# EasyEDA Pro project ProDoc_ChisFlash-MBCX-CQZ_2025-11-29.epro, board ChisFlash-MBCX-CQZ
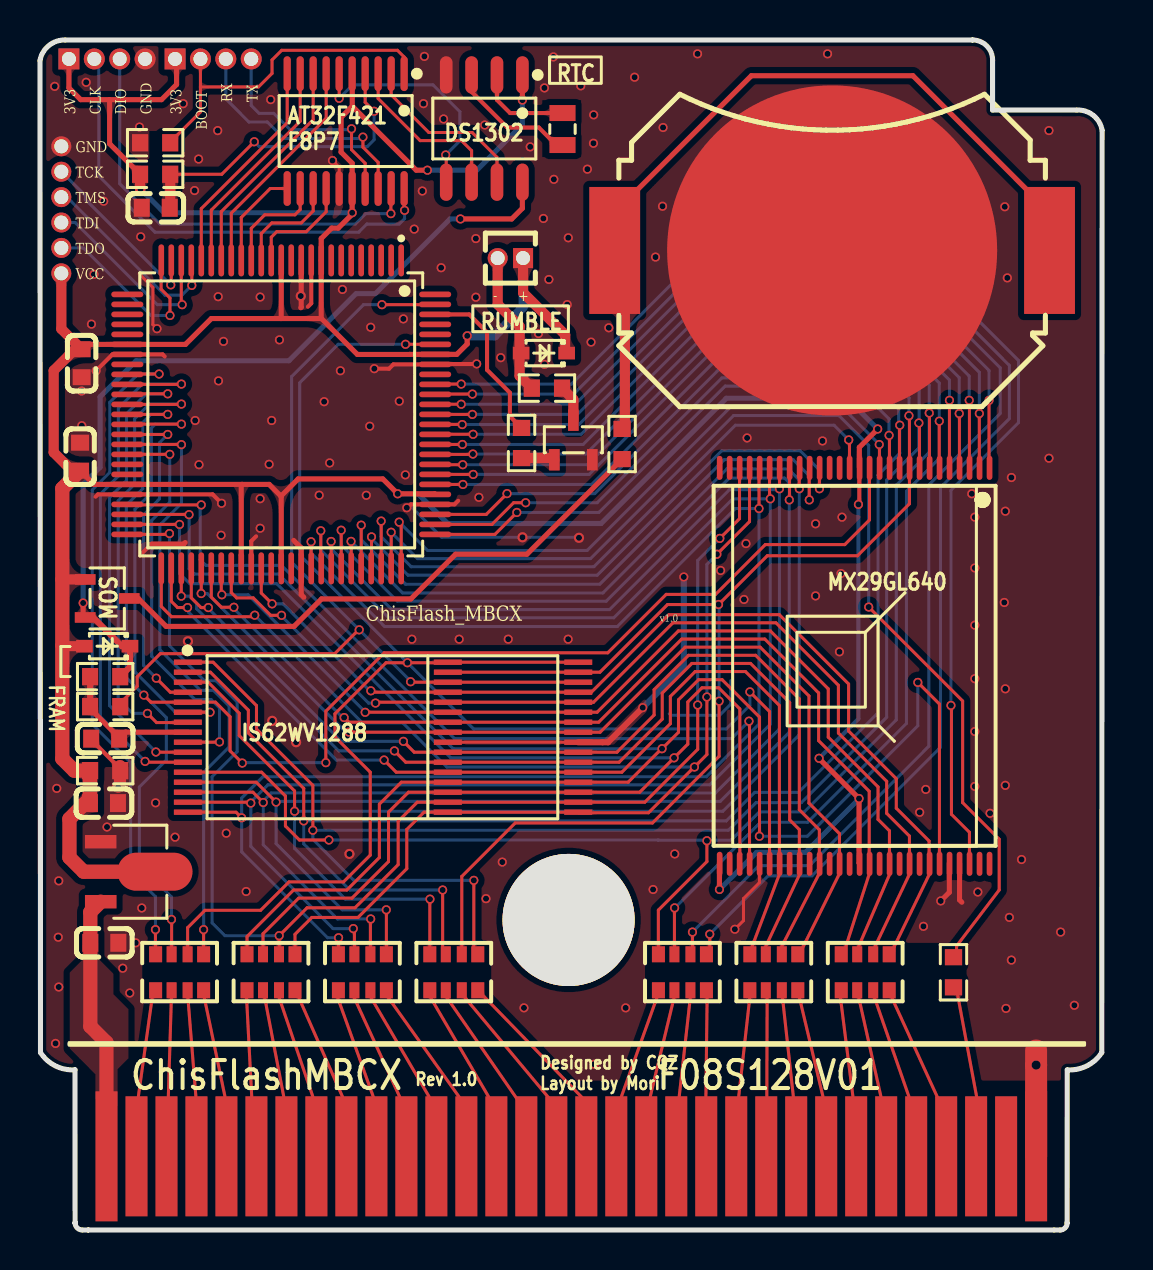
[diagram p1: board, top side]
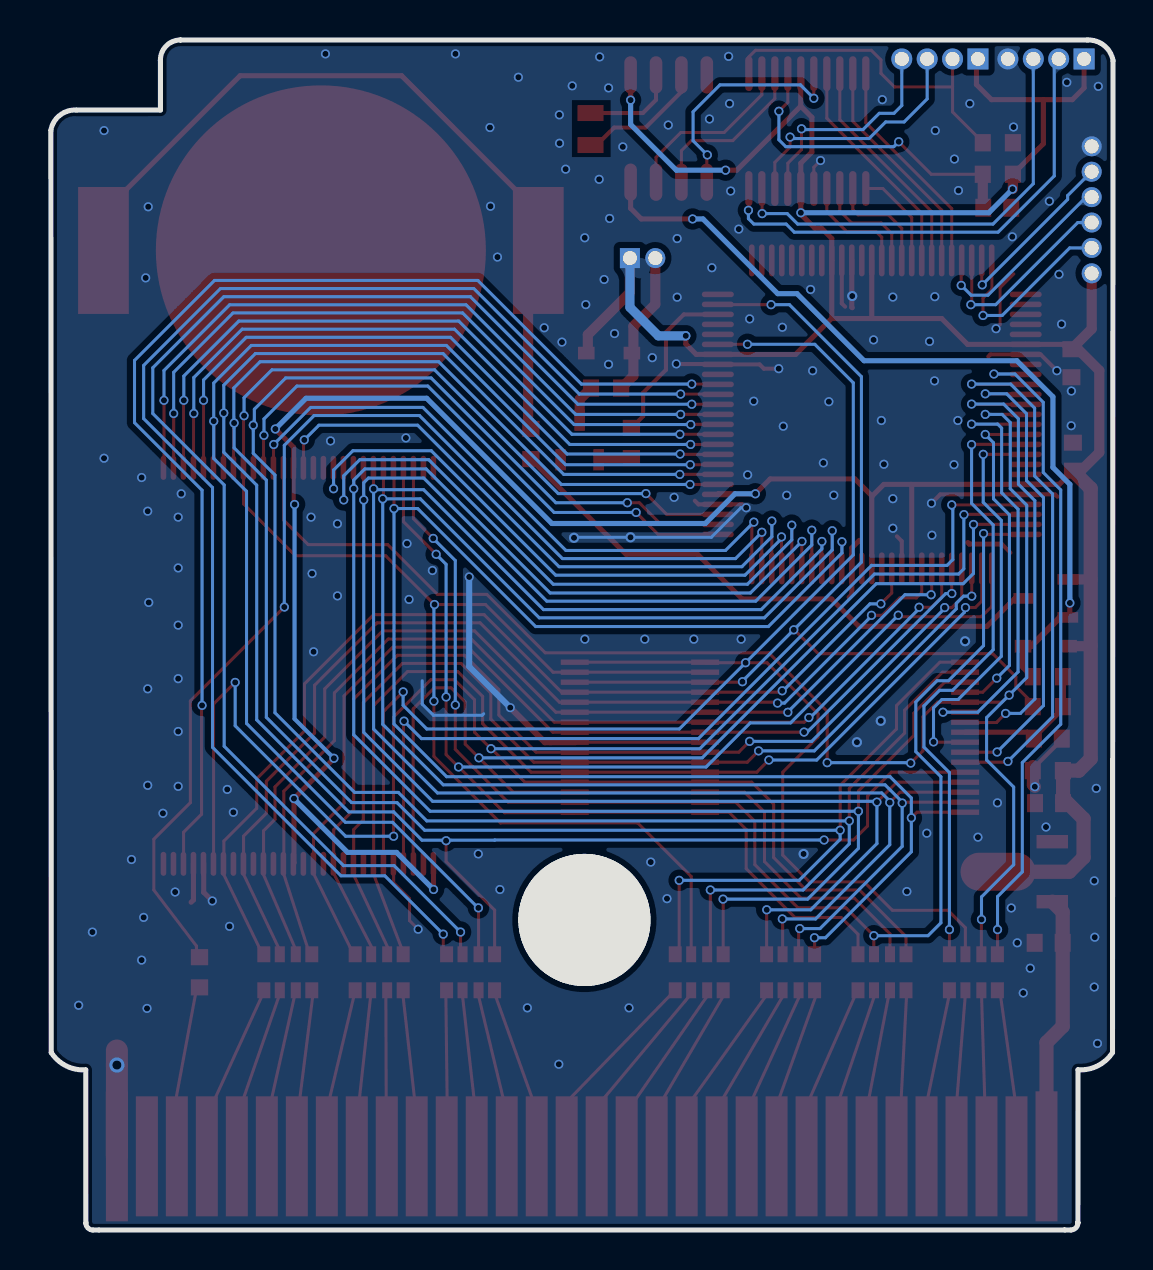
[diagram p2: board, bottom side, seen from below]

Outline 53.13 x 59.5 mm; copper layers: Top Layer, Bottom Layer. Coordinates in mm from the lower left corner of the outline.
Outline path: 1.76,0.36 1.76,0.36 arc(1.76,0.36) 1.76,0.36 ; 1.76,0.36 1.75,8.01 arc(0.77,8.21) 0.03,8.87 0,58.48 arc(0.45,59.23) 1.27,59.5 46.65,59.5 arc(47.36,59.21) 47.65,58.49 47.65,56 51.86,56 arc(52.69,55.74) 53.13,54.99 53.11,8.87 arc(52.37,8.21) 51.38,8.01 51.38,0.35 51.38,0.35 arc(51.28,0.1) 51.03,0 2.11,0 arc(1.86,0.11) 1.76,0.36
Stack: Top Layer 0.035mm / Dielectric1 1.51mm FR4 er 4.5 / Bottom Layer 0.035mm

## Design rules (mm)
template: 自定义配置
spacing copperThickness1oz (default): track to track 0.254, other pairs 0.152 to 0.152
spacing copperThickness2oz: track to track 0.203, other pairs 0.152 to 0.3
track width copperThickness1oz (default): min 0.152, default 0.152, max 2.54
track width copperThickness2oz: min 0.203, default 0.254, max 2.54
differential pair differentialPair (default): width min 0.127, default 0.254, max 2.54; gap min 0.152, default 0.152
via viaSize (default): diameter min 0.457, default 0.457, max 10; hole min 0.3, default 0.305, max 6.299

## Placement (name value [footprint] x y rotation side)
BT1  MY-2016-02  [BAT-SMD_MY-2032-08]  39.62 48.98 180 top
C2  100nF  [C0603]  3.26 24.57 0 top
C3  100nF  [C0603]  2.08 43.34 90 top
C4  100nF  [C0603]  2.01 38.67 270 top
C5  10uF  [C0603]  3.22 14.36 180 top
C6  10uF  [C0603]  3.2 21.34 180 top
C7  100nF  [C0603]  5.79 51.11 180 top
D1  RB751V-40  [SOD-323_L1.7-W1.3-LS2.6-RD-1]  3.36 29.19 180 top
D2  RB751V-40  [SOD-323_L1.7-W1.3-LS2.6-RD-1]  25.21 43.85 180 top
H3  PZ127V-11-02-H25  [HDR-TH_2P-P1.27-V-M-1]  23.53 48.6 180 top
J1  -  [ChisFlash-GBC卡框]  26.44 15.5 0 top
Q1  AO3415A  [SOT-23-3_L3.0-W1.7-P0.95-LS2.9-BR]  3.36 31.58 180 top
Q2  S8050  [SOT-23-3_L2.9-W1.3-P1.90-LS2.3-BR]  26.68 39.5 270 top
R1  10kΩ  [R0603]  3.26 26.17 180 top
R2  10kΩ  [R0603]  29.12 39.3 270 top
R3  10kΩ  [R0603]  3.26 22.97 0 top
R4  33Ω  [R0603]  45.69 12.89 270 top
R5  10kΩ  [R0603]  5.76 54.36 180 top
R6  10kΩ  [R0603]  5.76 52.79 180 top
R7  33Ω  [R0603]  25.36 42.1 180 top
R8  10kΩ  [R0603]  24.09 39.35 90 top
R9  0Ω  [R0603]  3.26 27.67 180 top
RN1  470Ω  [RES-ARRAY-SMD_0603-8P-L3.2-W1.6-BL]  11.56 12.89 0 top
RN2  470Ω  [RES-ARRAY-SMD_0603-8P-L3.2-W1.6-BL]  20.7 12.89 0 top
RN3  470Ω  [RES-ARRAY-SMD_0603-8P-L3.2-W1.6-BL]  16.13 12.89 0 top
RN4  470Ω  [RES-ARRAY-SMD_0603-8P-L3.2-W1.6-BL]  32.14 12.89 0 top
RN5  470Ω  [RES-ARRAY-SMD_0603-8P-L3.2-W1.6-BL]  36.71 12.89 0 top
RN6  470Ω  [RES-ARRAY-SMD_0603-8P-L3.2-W1.6-BL]  41.28 12.89 0 top
RN7  33Ω  [RES-ARRAY-SMD_0603-8P-L3.2-W1.6-BL]  6.98 12.89 0 top
U3  SRAM&FRAM-4M(512K)  [TSSOP-TSOP二合一_1]  18.16 24.62 180 top
U4  EPM240T100C5N  [TQFP-100_L14.0-W14.0-P0.50-LS16.0-BL]  12.07 40.78 180 top
U5  S29GL256N10TFI010  [TSOP-56_L18.4-W14.0-P0.50-LS20.0-TL]  40.75 28.21 270 top
U7  AT32F421F8P7  [TSSOP-20_L6.5-W4.4-P0.65-LS6.4-BL]  15.29 54.95 180 top
U9  DS1302Z  [SOP-8_L4.9-W3.9-P1.27-LS6.0-BL-1]  22.22 55.08 180 top
U10  AMS1117-3.3S  [SOT-89-3_L4.5-W2.5-P1.50-LS4.2-BR]  4.39 17.92 180 top
U12  X1311WR-04J-C40D24  [HDR-TH_4P-P1.27-H-M-W7.0-N_1]  3.35 58.56 0 top
U13  X1311WR-04J-C40D24  [HDR-TH_4P-P1.27-H-M-W7.0-N_1]  8.66 58.56 0 top
X1  32.768kHz  [CRYSTAL-SMD_2P-L2.0-W1.2]  26.14 55.05 90 top
XP1  JTAG  [HDR-TH_6P-P1.27-V-M-1]  1.07 51.01 90 top

## Footprints (pads in the part's own frame, mm; a bottom-side part is the same pattern mirrored in y, then rotated)
BAT-SMD_MY-2032-08
  rect 2.54x6.35 smd: 1(-10.875,0) 1(10.875,0)
  round 16.51 smd: 2(0,0)
C0603
  rect 0.8x0.9 smd: 1(-0.7,0) 2(0.7,0)
ChisFlash-GBC卡框
  round 6.604 hole 6.604: 0(0,0)
  rect 1.1x6.5 smd: 1(-23.114,-11.819) 32(23.386,-11.819)
  rect 1.1x6 smd: 2(-21.614,-11.819) 3(-20.114,-11.819) 4(-18.614,-11.819) 5(-17.114,-11.819) 6(-15.614,-11.819) 7(-14.114,-11.819) 8(-12.614,-11.819) 9(-11.114,-11.819) 10(-9.614,-11.819) 11(-8.114,-11.819) 12(-6.614,-11.819) 13(-5.114,-11.819) 14(-3.614,-11.819) 15(-2.114,-11.819) 16(-0.614,-11.819) 17(0.886,-11.819) 18(2.386,-11.819) 19(3.886,-11.819) 20(5.386,-11.819) 21(6.886,-11.819) 22(8.386,-11.819) 23(9.886,-11.819) 24(11.386,-11.819) 25(12.886,-11.819) 26(14.386,-11.819) 27(15.886,-11.819) 28(17.386,-11.819) 29(18.886,-11.819) 30(20.386,-11.819) 31(21.886,-11.819)
CRYSTAL-SMD_2P-L2.0-W1.2
  rect 0.8x1.3 smd: 1(-0.8,0) 2(0.8,0)
HDR-TH_2P-P1.27-V-M-1
  rect 1x1 hole 0.7: 1(-0.635,0)
  round 1 hole 0.7: 2(0.635,0)
HDR-TH_4P-P1.27-H-M-W7.0-N_1
  rect 1.05x1.05 hole 0.7: 1(-1.905,0)
  round 1.05 hole 0.7: 2(-0.635,0) 3(0.635,0) 4(1.905,0)
HDR-TH_6P-P1.27-V-M-1
  round 1 hole 0.7: 1(-3.175,0) 2(-1.905,0) 3(-0.635,0) 4(0.635,0) 5(1.905,0) 6(3.175,0)
R0603
  rect 0.806x0.864 smd: 1(-0.753,0) 2(0.753,0)
RES-ARRAY-SMD_0603-8P-L3.2-W1.6-BL
  rect 0.65x0.8 smd: 1(-1.2,-0.9) 4(1.2,-0.9) 5(1.2,0.9) 8(-1.2,0.9)
  rect 0.5x0.8 smd: 2(-0.4,-0.9) 3(0.4,-0.9) 6(0.4,0.9) 7(-0.4,0.9)
SOD-323_L1.7-W1.3-LS2.6-RD-1
  rect 0.83x0.63 smd: 1(-1.14,0) 2(1.14,0)
SOP-8_L4.9-W3.9-P1.27-LS6.0-BL-1
  oval 0.63x1.865 smd: 1(-1.905,-2.683) 2(-0.635,-2.683) 3(0.635,-2.683) 4(1.905,-2.683) 5(1.905,2.683) 6(0.635,2.683) 7(-0.635,2.683) 8(-1.905,2.683)
SOT-23-3_L2.9-W1.3-P1.90-LS2.3-BR
  rect 1.07x0.532 smd: 1(0.99,-0.95) 2(0.99,0.95) 3(-0.99,0)
SOT-23-3_L3.0-W1.7-P0.95-LS2.9-BR
  rect 1.038x0.532 smd: 1(1.101,-0.95) 2(1.101,0.95) 3(-1.101,0)
SOT-89-3_L4.5-W2.5-P1.50-LS4.2-BR
  rect 1.575x0.672 smd: 1(1.356,-1.5) 3(1.356,1.5)
  custom 5.377x1.9 smd: 2(-1.356,0)
TQFP-100_L14.0-W14.0-P0.50-LS16.0-BL
  oval 0.28x1.6 smd: 1(-6,-7.7) 2(-5.5,-7.7) 3(-5,-7.7) 4(-4.5,-7.7) 5(-4,-7.7) 6(-3.5,-7.7) 7(-3,-7.7) 8(-2.5,-7.7) 9(-2,-7.7) 10(-1.5,-7.7) 11(-1,-7.7) 12(-0.5,-7.7) 13(0,-7.7) 14(0.5,-7.7) 15(1,-7.7) 16(1.5,-7.7) 17(2,-7.7) 18(2.5,-7.7) 19(3,-7.7) 20(3.5,-7.7) 21(4,-7.7) 22(4.5,-7.7) 23(5,-7.7) 24(5.5,-7.7) 25(6,-7.7) 51(6,7.7) 52(5.5,7.7) 53(5,7.7) 54(4.5,7.7) 55(4,7.7) 56(3.5,7.7) 57(3,7.7) 58(2.5,7.7) 59(2,7.7) 60(1.5,7.7) 61(1,7.7) 62(0.5,7.7) 63(0,7.7) 64(-0.5,7.7) 65(-1,7.7) 66(-1.5,7.7) 67(-2,7.7) 68(-2.5,7.7) 69(-3,7.7) 70(-3.5,7.7) 71(-4,7.7) 72(-4.5,7.7) 73(-5,7.7) 74(-5.5,7.7) 75(-6,7.7)
  oval 1.6x0.28 smd: 26(7.7,-6) 27(7.7,-5.5) 28(7.7,-5) 29(7.7,-4.5) 30(7.7,-4) 31(7.7,-3.5) 32(7.7,-3) 33(7.7,-2.5) 34(7.7,-2) 35(7.7,-1.5) 36(7.7,-1) 37(7.7,-0.5) 38(7.7,0) 39(7.7,0.5) 40(7.7,1) 41(7.7,1.5) 42(7.7,2) 43(7.7,2.5) 44(7.7,3) 45(7.7,3.5) 46(7.7,4) 47(7.7,4.5) 48(7.7,5) 49(7.7,5.5) 50(7.7,6) 76(-7.7,6) 77(-7.7,5.5) 78(-7.7,5) 79(-7.7,4.5) 80(-7.7,4) 81(-7.7,3.5) 82(-7.7,3) 83(-7.7,2.5) 84(-7.7,2) 85(-7.7,1.5) 86(-7.7,1) 87(-7.7,0.5) 88(-7.7,0) 89(-7.7,-0.5) 90(-7.7,-1) 91(-7.7,-1.5) 92(-7.7,-2) 93(-7.7,-2.5) 94(-7.7,-3) 95(-7.7,-3.5) 96(-7.7,-4) 97(-7.7,-4.5) 98(-7.7,-5) 99(-7.7,-5.5) 100(-7.7,-6)
TSOP-56_L18.4-W14.0-P0.50-LS20.0-TL
  oval 1.2x0.28 smd: 1(-9.9,6.75) 2(-9.9,6.25) 3(-9.9,5.75) 4(-9.9,5.25) 5(-9.9,4.75) 6(-9.9,4.25) 7(-9.9,3.75) 8(-9.9,3.25) 9(-9.9,2.75) 10(-9.9,2.25) 11(-9.9,1.75) 12(-9.9,1.25) 13(-9.9,0.75) 14(-9.9,0.25) 15(-9.9,-0.25) 16(-9.9,-0.75) 17(-9.9,-1.25) 18(-9.9,-1.75) 19(-9.9,-2.25) 20(-9.9,-2.75) 21(-9.9,-3.25) 22(-9.9,-3.75) 23(-9.9,-4.25) 24(-9.9,-4.75) 25(-9.9,-5.25) 26(-9.9,-5.75) 27(-9.9,-6.25) 28(-9.9,-6.75) 29(9.9,-6.75) 30(9.9,-6.25) 31(9.9,-5.75) 32(9.9,-5.25) 33(9.9,-4.75) 34(9.9,-4.25) 35(9.9,-3.75) 36(9.9,-3.25) 37(9.9,-2.75) 38(9.9,-2.25) 39(9.9,-1.75) 40(9.9,-1.25) 41(9.9,-0.75) 42(9.9,-0.25) 43(9.9,0.25) 44(9.9,0.75) 45(9.9,1.25) 46(9.9,1.75) 47(9.9,2.25) 48(9.9,2.75) 49(9.9,3.25) 50(9.9,3.75) 51(9.9,4.25) 52(9.9,4.75) 53(9.9,5.25) 54(9.9,5.75) 55(9.9,6.25) 56(9.9,6.75)
TSSOP-20_L6.5-W4.4-P0.65-LS6.4-BL
  oval 0.364x1.742 smd: 1(-2.925,-2.871) 2(-2.275,-2.871) 3(-1.625,-2.871) 4(-0.975,-2.871) 5(-0.325,-2.871) 6(0.325,-2.871) 7(0.975,-2.871) 8(1.625,-2.871) 9(2.275,-2.871) 10(2.925,-2.871) 11(2.925,2.871) 12(2.275,2.871) 13(1.625,2.871) 14(0.975,2.871) 15(0.325,2.871) 16(-0.325,2.871) 17(-0.975,2.871) 18(-1.625,2.871) 19(-2.275,2.871) 20(-2.925,2.871)
TSSOP-TSOP二合一_1
  rect 1.399x0.27 smd: 1(10.762,-3.769) 2(10.762,-3.269) 3(10.762,-2.769) 4(10.762,-2.269) 5(10.762,-1.769) 6(10.762,-1.269) 7(10.762,-0.769) 8(10.762,-0.269) 9(10.762,0.231) 10(10.762,0.731) 11(10.762,1.231) 12(10.762,1.731) 13(10.762,2.231) 14(10.762,2.731) 15(10.762,3.231) 16(10.762,3.731) 17(-8.763,3.731) 17(-2.243,3.731) 18(-8.763,3.231) 18(-2.243,3.231) 19(-8.763,2.731) 19(-2.243,2.731) 20(-8.763,2.231) 20(-2.243,2.231) 21(-8.763,1.731) 21(-2.243,1.731) 22(-8.763,1.231) 22(-2.243,1.231) 23(-8.763,0.731) 23(-2.243,0.731) 24(-8.763,0.231) 24(-2.243,0.231) 25(-8.763,-0.269) 25(-2.243,-0.269) 26(-8.763,-0.769) 26(-2.243,-0.769) 27(-8.763,-1.269) 27(-2.243,-1.269) 28(-8.763,-1.769) 28(-2.243,-1.769) 29(-8.763,-2.269) 29(-2.243,-2.269) 30(-8.763,-2.769) 30(-2.243,-2.769) 31(-8.763,-3.269) 31(-2.243,-3.269) 32(-8.763,-3.769) 32(-2.243,-3.769)

## Nets
As in the schematic.

Pads without a net: J1 0; U4 1 6 7 8 12 26 33 43 44 62 64 96 97 100; U5 16 17 27 28 30 36 38 40 42 45 47 49 55 56

## Via types
v1: diameter 0.457, hole 0.305, Top Layer to Bottom Layer, 295 vias
v2: diameter 0.508, hole 0.305, Top Layer to Bottom Layer, 7 vias
v3: diameter 0.762, hole 0.457, Top Layer to Bottom Layer, 1 via

## Routing (per net, layer and track width the routed paths; a pad name or vN(x,y) marks a point on that pad's centre or on a via; arc(x,y) is an arc through that point)
+3V3: length 215.1
  Top Layer w0.203: v1(40.94,36.28) 40.98,36.32 40.98,38.15
  Top Layer w0.254: U4.80 19.74,36.81 v1(17.89,36.81) 17.15,37.55 12.91,37.55 12.05,36.69 ; C4.2 2.69,37.28 U4.45 10.11,37.28 ; 3.48,56.52 6.08,56.52 6.83,57.27 6.83,58.48 U13.1 ; 3.48,56.52 3.48,54.31 R6.2 ; 3.48,56.52 2.04,56.52 1.45,57.11 U12.1 ; 10.11,37.28 11.46,37.28 12.05,36.69 ; 10.11,37.28 10.07,37.24 U4.59 ; v1(38.97,23.59) 38.97,23.57 v1(40.97,21.57) 40.97,18.36 40.98,18.34 ; 14.07,45.59 14.06,45.58 12.05,45.58 ; 14.07,45.59 U4.9 14.07,49.58 14.59,50.1 14.92,50.1 15.62,50.79 v1(15.62,50.86) U7.16 15.62,53.34 15.06,53.9 15.06,55.63 15.62,56.19 ; 14.07,45.59 15.88,43.78 18.5,43.78 18.5,43.78 U4.94 20.85,43.78 21.37,44.31 v1(21.37,44.71) ; v1(41.9,40.05) 40.98,39.13 40.98,38.15 ; 12.05,36.69 12.07,36.68 U4.63 ; 15.62,56.19 15.62,57.81 U7.5 ; 15.62,56.19 18.82,52.99 v1(19.38,52.99) ; 12.05,45.58 12.07,45.59 U4.13 ; 12.05,45.58 8.57,45.58 7.28,44.28 U4.31 2.5,44.28 2.08,43.86 ; 33.99,18.34 v1(33.99,17.03) ; v1(24.13,56.5) U9.1
  Top Layer w0.508: v1(5.03,52.05) 5.01,52.07 R6.2 ; 26.27,43.85 26.27,44.77 24.16,46.87 H3.1 ; XP1.1 1.07,45.06 C3.2 1.75,44.04 0.69,42.98 0.69,38.88 1.6,37.97 C4.2 ; D1.2 1.14,29.19 1.12,29.22 ; Q1.1 1.12,32.53
  Top Layer w0.711: 2.5,22.97 1.71,22.97 1.12,23.56 1.12,37.08 C4.2 ; 2.5,22.97 2.5,21.58 ; 2.5,22.97 R3.1 ; 2.5,21.58 2.5,21.43 2.52,21.41 ; 2.5,21.58 1.47,20.56 1.47,18.63 2.18,17.92 4.81,17.92
  Bottom Layer w0.203: v1(40.94,36.28) 40.94,25.56 v1(38.97,23.59)
  Bottom Layer w0.254: v1(40.97,21.57) 40.97,21.56 38.29,18.88 35.84,18.88 v1(33.99,17.03) ; v1(5.03,52.05) 6.21,50.86 v1(15.62,50.86) ; v1(19.38,52.99) 21.84,52.99 24.13,55.28 v1(24.13,56.5) ; v1(41.9,40.05) 40.37,41.59 34.33,41.59 28.07,35.33 20.39,35.33 18.91,36.81 v1(17.89,36.81)
  Bottom Layer w0.457: H3.1 24.16,46.13 22.74,44.71 v1(21.37,44.71)
+5V: length 13.3
  Top Layer w0.711: J1.1 3.33,9.37 2.52,10.18 C5.2 2.52,15.9 3.04,16.42
GND: length 82.3
  Top Layer w0.152: 4.96,47.81 5.65,47.12 5.65,45.27 v1(5.85,45.07) ; U3.24 U3.24 ; v1(14.63,53.48) 14.97,53.14 U7.15 ; 35.99,18.34 35.99,17.37 35.19,16.57 35.19,15.47 v1(34.76,15.04) ; 28.14,24.39 28.17,24.42
  Top Layer w0.203: 6.24,43.68 6.13,43.78 U4.32 3.62,43.78 v1(2.81,42.97) ; 2.74,24.32 2.76,24.32 3.82,23.26 ; 18.28,36.01 18.55,36.28 U4.79 20.74,36.28 20.92,36.46 ; 10.81,34.69 10.57,34.44 U4.60 ; 5.56,34.3 5.13,33.87 ; v1(21.84,43.31) 21.84,43.3 19.79,43.3 U4.93 17.68,43.28 17.46,43.07 v1(16.72,43.07) ; U4.10 13.57,46.33 13.4,46.17 ; U4.11 13.05,48.5 ; v1(9.08,36.34) 8.64,36.78 U4.46 2.9,36.78 2.78,36.67
  Top Layer w0.254: 13.04,46.12 13.07,46.14 U4.11 ; 12.69,34.48 13.07,34.1 U4.65 13.07,31.77 13.2,31.64 ; 7.26,34.37 7.19,34.3 5.59,34.3 ; 46.11,16.39 46,16.5 46,18.31 ; 45.49,18.34 45.49,16.88 v1(45.06,16.45)
  Top Layer w0.305: v1(30.15,26.12) 28.42,24.39 U3.24
  Top Layer w0.61: 4,23.2 4,22.26 v1(3.91,22.16)
  Top Layer w1.1: 49.83,8.97 v3(49.83,8.25) J1.32
  Bottom Layer w0.152: 34.55,27.46 34.55,26.3 33.99,25.74 31.56,25.74 31.48,25.81 ; v2(26.96,34.61) 26.94,34.64 v2(24.14,34.64) 20.09,34.64 18.61,36.11 v1(18.35,36.11)
  Bottom Layer w0.305: v1(30.15,26.12) 32.2,28.17 v1(32.2,32.65)
  vias: v1(0.74,57.18) v1(0.78,9.33) v1(0.84,22.08) v1(0.94,17.46) v1(0.91,14.64) v1(0.94,12.15) v1(2.08,41.95) v1(2.09,40.22) v1(2.31,57.39) v1(2.57,45.3) v1(2.7,47.78) v1(3.18,51.44) v1(3.35,20.15) v1(4.14,13.09) v1(4.49,11.85) v1(4.79,14.36) v1(4.98,55.15) v1(5.04,49.66) v1(5.09,16.1) v1(5.78,21.36) v1(6.76,19.64) v1(7.16,56.32) v1(7.73,51.98) v1(7.76,40.48) v1(7.93,53.55) v1(7.95,38.27) v1(8.89,54.97) v1(8.91,46.67) v1(8.93,42.46) v1(9.06,34.74) v1(9.18,44.43) v1(9.32,19.84) v1(10.31,16.93) v1(11.01,46.65) v1(11.01,36.57) v1(11.01,35.09) v1(11.46,38.29) v1(11.54,56.52) v1(11.59,40.48) v1(11.98,44.51) v1(13.97,36.74) v1(14.21,41.42) v1(14.49,38.36) v1(15.03,42.97) v1(15.13,47.03) v1(16.32,36.74) v1(16.54,45.14) v1(16.49,40.19) v1(17.97,41.44) v1(18.18,45.56) v1(18.28,37.76) v1(18.6,29.54) v1(18.72,50.05) v1(19.18,56.32) v1(19.13,51.95) v1(19.23,58.68) v1(20.07,48.12) v1(20.19,55.55) v1(20.97,29.54) v1(21.8,49.57) v1(21.8,46.64) v1(21.96,36.63) v1(22.25,55.25) v1(22.31,16.57) v1(23.05,43.62) v1(23.12,18.4) v1(23.42,29.54) v1(24.21,11.11) v1(24.52,54.16) v1(24.93,44.83) v1(25.18,50.58) v1(25.23,57.11) v1(25.23,43.28) v1(25.46,47.53) v1(25.68,58.66) v1(25.7,52.54) v1(26.37,46.27) v1(26.43,49.61) v1(26.42,29.54) v1(27.05,57.21) v1(27.38,53.04) v1(27.56,44.4) v1(27.69,54.34) v1(27.7,55.76) v1(27.72,8.29) v1(28.45,45.11) v1(29.3,11.11) v1(29.74,57.64) v1(30.67,17.03) v1(30.79,48.65) v1(31.17,55.13) v1(31.14,51.19) v1(31.75,18.8) v1(32.89,58.81) v1(34.05,32.98) v1(35.21,31.53) v1(35.37,39.61) v1(35.32,34.32) v1(38.8,35.31) v1(38.8,31.71) v1(39.14,39.45) v1(39.4,58.81) v1(39.99,28.91) v1(40.06,32.82) v1(40.12,35.64) v1(44,20.89) v1(44.19,15.18) v1(44.31,22.03) v1(46.61,36.81) v1(46.76,35.64) v1(46.76,33.1) v1(46.76,30.24) v1(46.76,27.57) v1(46.76,24.93) v1(46.76,22.18) v1(46.91,16.9) v1(47.52,20.84) v1(48.26,51.16) v1(48.28,35.94) v1(48.23,31.38) v1(48.28,27.06) v1(48.28,22.23) v1(48.39,47.61) v1(48.32,11.08) v1(48.49,15.63) v1(48.59,37.63) v1(48.59,13.5) v1(49.1,18.53) v1(50.47,54.97) v1(50.47,38.59) v1(51.05,14.9) v1(51.74,11.24) v2(7.4,29.44) v2(11.62,25.46) v2(12.81,24.39) v2(13.04,46.7) v2(15.48,18.8)
A0: length 95.8
  Top Layer w0.152: U4.48 7.44,35.78 v1(7.46,35.77) ; 44.99,18.64 44.99,26.3 v1(43.91,27.38) ; v1(31.11,24.07) 31.94,24.89 31.94,26.51 32.94,27.52 34.12,27.52 35.99,25.65 35.99,19.69 v1(35.99,19.69) ; 31.1,24.08 29.42,22.39 U3.20 U3.20 18.07,22.39 16.98,21.29 16.98,18.63 15.35,17 12.68,17 10.36,14.67 RN1.8
  Bottom Layer w0.152: v1(31.11,24.07) 20.67,24.07 11.93,32.8 7.72,32.8 7.46,33.06 7.46,35.72 ; v1(43.91,27.38) 43.91,25.21 38.38,19.69 v1(35.99,19.69)
A0_EXT: length 5.6
  Top Layer w0.152: 10.62,6.2 10.32,11.84
A1: length 74.1
  Top Layer w0.152: 34.99,18.64 35.01,18.65 35.01,26.05 33.95,27.11 33.11,27.11 32.4,26.4 32.4,24.3 v1(31.72,23.61) 30,21.89 U3.19 U3.19 18.43,21.89 17.43,20.89 17.43,18.42 15.6,16.59 12.94,16.59 11.16,14.81 RN1.7 ; U4.49 6.98,35.28 v1(6.98,35.28)
  Bottom Layer w0.152: v1(31.72,23.61) 20.55,23.61 11.84,32.32 7.49,32.32 6.98,32.83 v1(6.98,35.28)
A1_EXT: length 5.5
  Top Layer w0.152: 12.24,6.45 11.2,11.86
A2: length 69.7
  Top Layer w0.152: U4.50 6.43,34.78 v1(6.48,34.82) ; 34.99,38.38 34.99,35.57 v1(34,34.58) ; v1(32.9,26.25) 32.9,24.04 30.25,21.39 U3.18 U3.18 18.87,21.39 17.92,20.44 17.92,18.27 15.76,16.11 13.36,16.11 v1(11.96,14.72) 11.96,13.79 RN1.6
  Bottom Layer w0.152: v1(34,34.58) 32.9,33.48 v1(32.9,26.25) ; v1(6.48,34.82) 6.48,29.22 8.23,27.47 8.8,27.47 9.86,26.4 9.86,23.92 8.61,22.67 8.61,15.36 9.25,14.72 v1(11.96,14.72)
A2_EXT: length 5.8
  Top Layer w0.152: 13.77,6.32 11.91,11.77
A3: length 73.9
  Top Layer w0.152: 32.73,23.16 30.44,20.86 26.95,20.86 U3.17 U3.17 19.21,20.89 18.35,20.03 18.35,18.07 15.91,15.63 13.6,15.63 12.76,14.79 RN1.5 ; v1(32.74,23.15) 33.36,23.78 v1(33.36,26.65) ; v1(10.74,30.74) 10.67,30.67 6.58,30.67 6.07,31.18 U4.51 ; 35.49,38.38 35.49,35.42 v1(33.86,33.79)
  Bottom Layer w0.152: v1(10.74,30.74) 16.13,25.36 18.15,25.36 20.35,23.15 v1(32.74,23.15) ; v1(33.36,26.65) 33.36,33.29 33.86,33.78 v1(33.86,33.79)
A3_EXT: length 6.1
  Top Layer w0.152: 15.23,6.44 12.79,11.98
A4: length 81.7
  Top Layer w0.152: U3.16 9.81,20.89 v1(10.09,20.61) ; v1(13.56,34.41) 13.56,33.09 U4.66 ; 35.99,38.38 35.97,38.35 v1(35.97,36.07) ; v1(14.94,14.61) 14.93,14.61 RN3.8
  Bottom Layer w0.152: v1(13.56,34.41) 13.56,33.85 17.24,30.17 28.88,30.17 34.78,36.07 v1(35.97,36.07) 35.97,25.3 33.33,22.67 11.15,22.67 10.09,21.6 v1(10.09,20.61) 10.09,18.91 14.38,14.61 v1(14.94,14.61)
A4_EXT: length 5.5
  Top Layer w0.152: 16.75,6.44 14.89,11.63
A5: length 83.4
  Top Layer w0.152: U3.15 10.5,21.39 v1(10.55,21.35) ; U4.67 14.05,33.1 v1(14.05,34.96) ; 36.49,38.38 36.49,36.6 v1(36.53,36.56) ; RN3.7 15.73,15.01 v1(15.67,15.07)
  Bottom Layer w0.152: v1(14.05,34.96) 14.05,34 17.44,30.61 28.7,30.61 34.65,36.56 v1(36.53,36.56) 36.53,25.29 33.5,22.26 11.4,22.26 10.55,21.4 v1(10.55,21.35) 10.55,19.18 14.66,15.07 v1(15.67,15.07)
A5_EXT: length 6
  Top Layer w0.152: 18.22,6.17 15.7,11.65
A6: length 83.4
  Top Layer w0.152: U3.14 10.65,21.89 v1(11.17,21.37) ; U4.68 14.57,34.42 v1(14.56,34.43) ; v1(36.99,37.06) 36.99,37.07 36.99,38.38 ; RN3.6 16.53,15.54 v1(16.54,15.55)
  Bottom Layer w0.152: v1(16.54,15.55) 14.88,15.55 11.17,19.26 v1(11.17,21.37) 11.17,21.45 11.57,21.85 33.79,21.85 36.99,25.05 v1(36.99,37.06) 36.94,37.02 34.49,37.02 28.49,31.02 17.6,31.02 14.56,34.06 v1(14.56,34.43)
A6_EXT: length 6.1
  Top Layer w0.152: 16.52,11.69 19.59,6.45
A7: length 86.4
  Top Layer w0.152: 15.07,34.99 U4.69 ; U3.13 10.81,22.39 v1(11.81,21.4) ; v1(37.48,36.51) 37.49,36.52 37.49,38.38 ; v1(17.32,16.01) 17.33,16.01 RN3.5
  Bottom Layer w0.152: v1(17.32,16.01) 15.12,16.01 11.81,19.32 v1(11.81,21.4) 11.85,21.43 34.03,21.43 37.48,24.88 v1(37.48,36.51) 37.48,37.37 37.25,37.6 34.48,37.6 28.32,31.44 17.88,31.44 15.07,34.25 v1(15.07,34.99)
A7_EXT: length 6.4
  Top Layer w0.152: 17.35,11.72 21.09,6.48
A8: length 90.2
  Top Layer w0.152: U3.3 8.41,27.39 9.97,25.84 9.97,24.72 12.73,21.95 v1(12.73,20.94) ; v1(19.51,16.54) 19.5,16.54 RN2.8 ; U4.70 15.57,34.42 v1(15.56,34.43) ; 37.99,38.38 37.98,38.37 v1(37.98,37.06)
  Bottom Layer w0.152: v1(15.56,34.43) 18.14,31.85 28.15,31.85 34.36,38.06 37.42,38.06 37.98,37.5 v1(37.98,37.06) 37.98,24.76 34.16,20.94 v1(12.73,20.94) 12.73,19.09 15.28,16.54 v1(19.51,16.54)
A8_EXT: length 6.2
  Top Layer w0.152: 19.45,11.77 22.59,6.4
A9: length 98.2
  Top Layer w0.152: 19.77,35.28 22.61,35.28 23.69,36.36 v1(24.29,36.36) ; U3.2 8.52,27.89 10.42,25.99 10.42,24.85 13.19,22.08 v1(13.19,20.46) ; RN2.7 20.14,13.94 v1(20.14,17) ; v1(43.01,40.24) 42.99,40.23 42.99,38.38
  Bottom Layer w0.152: v1(20.14,17) 15.5,17 13.19,19.31 v1(13.19,20.46) 34.32,20.46 35.75,21.88 37.94,21.88 41.92,25.86 41.92,37.75 43.01,38.84 v1(43.01,40.24) 42.95,40.3 42.95,41.04 41.38,42.6 34.11,42.6 27.87,36.36 v1(24.29,36.36)
A9_EXT: length 6.5
  Top Layer w0.152: 20.28,11.73 23.97,6.4
A10: length 86
  Top Layer w0.152: RN2.6 21.1,17.68 23.77,20.35 30.64,20.35 33.97,23.68 v1(33.97,26.44) ; v1(23.36,36.82) 22.32,35.78 U4.78 ; U3.31 U3.31 28.01,27.89 31.39,31.27 v1(33.94,31.27) 36.38,33.71 40.89,33.71 43.49,36.31 43.49,40.69 v1(43.47,40.72)
  Bottom Layer w0.152: v1(43.47,40.72) 43.47,41.62 42.07,43.01 33.94,43.01 27.75,36.82 v1(23.36,36.82) ; v1(33.97,26.44) 33.97,31.25 v1(33.94,31.28)
A10_EXT: length 7
  Top Layer w0.152: 25.65,6.37 21.44,11.4 arc(21.4,11.44) 21.37,11.49 21.15,11.75
A11: length 102.3
  Top Layer w0.152: v1(21.16,37.28) 19.77,37.28 U4.81 ; RN2.5 21.7,13.98 v1(21.7,17.48) ; U3.1 8.66,28.39 10.83,26.22 10.83,25.05 13.65,22.23 v1(13.65,19.99) ; v1(43.96,40.35) 43.99,40.32 43.99,38.38
  Bottom Layer w0.152: v1(21.16,37.28) 27.59,37.28 33.73,43.42 42.66,43.42 43.98,42.1 43.98,40.37 v1(43.96,40.35) 43.96,39.11 42.35,37.5 42.35,25.64 38.09,21.37 35.81,21.37 34.43,19.99 v1(13.65,19.99) 13.65,19.53 15.7,17.48 v1(21.7,17.48)
A11_EXT: length 7.6
  Top Layer w0.152: 21.99,11.9 27.27,6.46
A12: length 94.7
  Top Layer w0.152: v1(14.45,19.5) 12.98,19.5 12.28,20.2 12.28,21.7 11.09,22.89 U3.12 ; RN4.8 30.93,13.79 30.93,15.99 33.36,18.42 v1(33.36,19.46) ; v1(44.48,40.85) 44.49,40.84 44.49,38.38 ; v1(21.67,37.78) U4.82
  Bottom Layer w0.152: v1(21.67,37.78) 27.47,37.78 33.51,43.82 42.9,43.82 44.48,42.24 v1(44.48,40.85) 44.48,38.89 42.83,37.24 42.83,25.51 38.23,20.91 35.98,20.91 34.57,19.49 30.93,19.49 30.92,19.5 v1(14.45,19.5)
A12_EXT: length 5.6
  Top Layer w0.152: 29.01,6.48 30.91,11.76
A13: length 66
  Top Layer w0.152: v1(21.15,38.27) 19.78,38.27 U4.83 ; v1(44.98,40.45) 44.98,38.39 44.99,38.38 ; RN4.7 31.74,16.1 v1(31.74,16.11)
  Bottom Layer w0.152: v1(21.15,38.27) 27.38,38.27 33.35,44.23 43.1,44.23 44.98,42.35 v1(44.98,40.45) 44.98,38.58 43.34,36.94 43.34,25.33 38.4,20.39 36.04,20.39 31.76,16.11 v1(31.74,16.11)
A13_EXT: length 5.5
  Top Layer w0.152: 30.47,6.43 31.74,11.73
A14: length 69.2
  Top Layer w0.152: v1(32.64,14.9) 32.64,13.89 RN4.6 ; v1(21.07,41.29) 19.78,41.29 U4.89
  Bottom Layer w0.152: v1(21.07,41.29) 26.77,41.29 32.15,46.67 44.47,46.67 48.03,43.11 48.03,40.83 44.46,37.25 44.46,24.19 38.49,18.22 35.96,18.22 v1(32.64,14.9)
A14_EXT: length 5.6
  Top Layer w0.152: 31.91,6.1 32.54,11.7
A15: length 69.5
  Top Layer w0.152: v1(21.63,41.8) 19.78,41.8 U4.90 ; v1(33.5,14.79) 33.5,13.95 RN4.5
  Bottom Layer w0.152: v1(21.63,41.8) 26.69,41.8 31.97,47.07 44.64,47.07 48.49,43.23 48.49,40.57 45.04,37.13 45.04,24.14 38.62,17.71 36.42,17.71 v1(33.5,14.79)
A15_EXT: length 5.6
  Top Layer w0.152: 33.3,6.28 33.37,11.85
BAT+: length 40.4
  Top Layer w0.254: BT1.1 28.75,50.88 35.59,57.72 43.66,57.72 50.5,50.88 BT1.1
  Top Layer w0.508: R2.1 29.26,40.19 29.26,46.57 28.75,47.07 BT1.1
BATQ1: length 28.7
  Top Layer w0.254: Q1.3 4.91,31.58 6.31,30.18 12.71,30.18 14.08,31.55 18.55,31.55 20.79,33.79 24.36,33.79 R2.2
BOOT0: length 17.1
  Top Layer w0.152: R5.1 6.51,54.39 8.03,55.91 8.03,57.16 ; U7.1 18.22,58.65 17.88,58.99 12.09,58.99 11.61,58.5 11.61,57.83 10.93,57.16 8.03,57.16 ; 8.03,57.16 U13.2
CE: length 11.9
  Top Layer w0.152: U7.6 v1(14.97,56.59) ; U9.5 20.32,53.73 v1(20.29,53.76)
  Bottom Layer w0.152: v1(20.29,53.76) 21.01,54.47 21.01,55.91 19.66,57.26 15.64,57.26 v1(14.97,56.59)
CLK: length 33.9
  Top Layer w0.152: U4.34 4.39,42.8 5.97,42.8 ; RN7.8 5.78,13.79 v1(5.78,15.02)
  Bottom Layer w0.152: v1(5.78,15.02) 5.78,16.67 4.54,17.91 4.54,23.37 2.62,25.29 2.62,37.01 3.49,37.88 3.49,41.39 4.91,42.8 5.97,42.8
  vias: v1(5.96,42.8)
CLK_EXT: length 5.6
  Top Layer w0.152: 4.87,6.33 5.65,11.87
CS: length 31
  Top Layer w0.152: U4.41 7.06,39.28 v1(7.08,39.27) ; 8.18,13.79 v1(8.18,15.02)
  Bottom Layer w0.152: v1(7.08,39.27) 7.08,36.33 5.99,35.25 5.99,29.02 8.03,26.98 8.68,26.98 9.46,26.2 9.46,24.15 8.18,22.87 v1(8.18,15.02)
CS0: length 5.6
  Top Layer w0.152: U7.14 14.32,50.91 13.32,49.92 11.85,49.92 11.57,49.64 U4.14
CS_EXT: length 5.6
  Top Layer w0.152: 8.17,11.86 9.31,6.4
D0: length 51.1
  Top Layer w0.152: U4.52 6.57,31.44 6.88,31.12 v1(7.38,31.12) ; 36.99,18.34 36.99,26.23 35.29,27.92 32.78,27.92 31.53,26.68 31.53,25.32 29.1,22.89 U3.21 U3.21 17.82,22.89 v1(17.21,23.5) ; 36.99,17.79 35.6,14.11
  Bottom Layer w0.152: v1(7.38,31.12) 7.43,31.07 7.43,30.89 14.82,23.5 v1(17.21,23.5)
D0_EXT: length 5.6
  Top Layer w0.152: 34.92,6.4 35.54,11.92
D1: length 51.4
  Top Layer w0.152: 37.98,18.34 37.98,20.02 37.5,20.51 37.5,26.37 35.54,28.33 32.61,28.33 31.12,26.85 31.12,25.55 28.97,23.39 U3.22 U3.22 18.3,23.39 v1(17.73,23.96) ; v1(7.07,31.69) 7.07,31.7 U4.53 ; 38.02,17.83 36.28,14.13
  Bottom Layer w0.152: v1(7.07,31.69) 7.48,31.69 7.84,31.34 7.84,31.06 14.94,23.96 v1(17.73,23.96)
D1_EXT: length 6.1
  Top Layer w0.152: 36.37,11.81 36.35,5.73
D2: length 51.6
  Top Layer w0.152: v1(18.18,24.43) 18.72,23.89 U3.23 U3.23 28.86,23.89 30.72,25.75 30.72,27.02 32.44,28.74 35.8,28.74 37.98,26.55 37.98,21.01 38.99,20.01 38.99,18.34 ; v1(8.42,31.12) 8.06,31.12 7.57,31.61 U4.54 ; 39,17.86 37.07,14.11
  Bottom Layer w0.152: v1(8.42,31.12) 8.42,31.08 15.07,24.43 v1(18.18,24.43)
D2_EXT: length 5.6
  Top Layer w0.152: 37.12,11.82 37.73,6.27
D3: length 50.3
  Top Layer w0.152: 39.99,18.64 39.99,19.82 38.47,21.34 38.47,26.7 36.03,29.14 32.27,29.14 28.02,24.89 U3.25 U3.25 15.46,24.89 v1(15.46,24.9) ; v1(8.06,31.83) 8.07,31.83 U4.55 ; 40,17.85 38.1,14.01
  Bottom Layer w0.152: v1(8.06,31.83) 8.37,31.83 15.29,24.9 v1(15.46,24.9)
D3_EXT: length 5.7
  Top Layer w0.152: 37.92,11.89 39.24,6.36
D4: length 50.8
  Top Layer w0.152: 40.17,13.75 41.48,17.79 ; v1(9.7,31.14) 9.08,31.14 8.57,31.65 U4.56 ; 41.49,18.64 41.48,18.65 41.48,21.94 38.95,24.47 38.95,26.86 36.25,29.55 32.1,29.55 27.94,25.39 U3.26 U3.26 15.45,25.39 v1(15.21,25.62)
  Bottom Layer w0.152: v1(9.7,31.14) 9.7,31.07 15.14,25.62 v1(15.21,25.62)
D4_EXT: length 5.6
  Top Layer w0.152: 40.02,11.81 40.71,6.29
D5: length 50.7
  Top Layer w0.152: v1(16.27,25.89) 16.27,25.89 U3.27 U3.27 27.87,25.89 31.93,29.96 36.53,29.96 39.43,27.06 39.43,24.65 41.92,22.16 41.92,20.53 42.49,19.96 42.49,18.64 ; v1(9.1,31.76) 9.07,31.79 U4.57 ; 40.91,14.1 42.51,17.81
  Bottom Layer w0.152: v1(9.1,31.76) 10.41,31.76 16.27,25.91 v1(16.27,25.89)
D5_EXT: length 6
  Top Layer w0.152: 40.9,11.88 42.22,5.99
D6: length 51.1
  Top Layer w0.152: 43.51,17.82 41.71,14.05 ; v1(12.08,30.74) 11.54,30.74 10.67,31.61 9.84,31.61 9.57,31.88 U4.58 ; v1(16.78,26.35) 16.82,26.39 U3.28 U3.28 27.69,26.39 31.66,30.36 36.81,30.36 39.94,27.24 39.94,24.85 42.35,22.44 42.35,20.84 43.49,19.7 43.49,18.64
  Bottom Layer w0.152: v1(16.78,26.35) 16.43,26.35 12.08,30.7 v1(12.08,30.74)
D6_EXT: length 6.1
  Top Layer w0.152: 41.68,11.82 43.67,6.08
D7: length 50.3
  Top Layer w0.152: 44.49,18.64 44.47,18.65 44.47,19.45 42.83,21.09 42.83,22.56 40.45,24.95 40.45,27.3 36.98,30.77 31.46,30.77 27.58,26.89 U3.29 U3.29 16.62,26.89 v1(16.55,26.96) ; 44.53,17.88 42.67,14.05 ; U4.61 11.07,31.85 v1(11.61,31.31)
  Bottom Layer w0.152: v1(11.61,31.31) 12.16,31.31 16.5,26.96 v1(16.55,26.96)
D7_EXT: length 6.2
  Top Layer w0.152: 42.51,11.84 45.08,6.22
EXT0: length 11.1
  Top Layer w0.152: U4.21 8.07,51.07 12.37,55.37 U7.10
EXT1: length 11.2
  Top Layer w0.152: U7.9 13.02,55.44 8.57,51 U4.20
EXT2: length 11.2
  Top Layer w0.152: U4.19 9.07,50.92 13.67,55.52 U7.8
EXT3: length 11.3
  Top Layer w0.152: U4.18 9.57,50.85 14.32,55.59 U7.7
IO: length 8.6
  Top Layer w0.152: U9.6 21.59,53.97 21.08,54.47 19.02,54.47 16.92,56.58 U7.3
MISO: length 5.5
  Top Layer w0.152: U7.12 13.02,51.03 12.75,50.76 11.24,50.76 10.57,50.09 U4.16
MOSI: length 5.5
  Top Layer w0.152: U7.13 13.67,50.95 13.07,50.36 11.6,50.36 11.07,49.83 U4.15
MOTO-: length 7.2
  Top Layer w0.508: R7.2 23.99,42.71 23.99,45.19 22.89,46.29 H3.2
MS: length 8.5
  Top Layer w0.203: U4.98 21.47,45.78 22.36,44.89 22.36,43.01 23.5,41.87 23.5,40.69 R8.2
NRST: length 16.3
  Top Layer w0.152: U7.4 16.27,56.39 v1(16.71,55.94) ; v1(10.72,54.42) 9.09,52.79 R6.1
  Top Layer w0.508: C7.1 6.51,51.14 R6.1
  Bottom Layer w0.152: v1(10.72,54.42) 10.96,54.17 16.37,54.17 16.71,54.51 v1(16.71,55.94)
RAM_A13: length 16.8
  Top Layer w0.152: v1(6.39,39.78) 4.37,39.78 U4.40 ; U3.4 6.52,26.89 v1(5.82,27.59)
  Bottom Layer w0.152: v1(5.82,27.59) 5.18,28.23 5.18,35.76 5.98,36.56 5.98,39.37 v1(6.39,39.78)
RAM_A14: length 27.5
  Top Layer w0.152: U3.11 5.3,23.39 v1(5.26,23.43) ; v1(7.08,42.3) 7.06,42.28 U4.35
  Bottom Layer w0.152: v1(7.08,42.3) 5.12,42.3 3.92,41.1 3.92,37.7 3.02,36.8 3.02,25.67 v1(5.26,23.43)
RAM_A15: length 23.9
  Top Layer w0.152: v1(5.37,25.83) 5.83,25.37 7.42,25.37 ; 7.42,25.37 7.6,25.37 ; 7.42,25.37 U3.7 ; U4.37 7.06,41.28 v1(7.08,41.3)
  Bottom Layer w0.152: v1(5.37,25.83) 4.63,25.83 3.91,26.55 3.91,36.47 4.73,37.29 4.73,40.56 5.47,41.3 v1(7.08,41.3)
RAM_A16: length 24.3
  Top Layer w0.152: v1(5.8,23.9) 5.81,23.89 U3.10 ; v1(6.39,41.81) 4.4,41.81 U4.36
  Bottom Layer w0.152: v1(5.8,23.9) 3.48,26.22 3.48,36.62 4.33,37.47 4.33,40.82 5.32,41.81 v1(6.39,41.81)
RAM_A17: length 20.3
  Top Layer w0.152: v1(8.98,24.41) 8.96,24.39 U3.9 ; v1(6.49,38.79) 4.37,38.79 U4.42
  Bottom Layer w0.152: v1(6.49,38.79) 6.49,36.39 5.59,35.48 5.59,28.69 7.75,26.53 8.56,26.53 8.98,26.11 v1(8.98,24.41)
RAM_A18: length 22.5
  Top Layer w0.152: v1(7.08,40.3) 4.38,40.3 U4.39 ; U3.6 v1(8.51,25.89)
  Bottom Layer w0.152: v1(7.08,40.3) 5.77,40.3 5.57,40.1 5.57,36.86 4.75,36.04 4.75,27.91 6.77,25.89 v1(8.51,25.89)
RAM_CS: length 48.7
  Top Layer w0.152: v1(17.1,46.27) 19.75,46.27 U4.99 ; U3.30 U3.30 18.56,27.39 v1(18.54,27.42) ; v1(15.97,30.01) 15.94,30.01 14.74,28.82 6.02,28.82 4.86,27.66 4.86,27.19 4.01,26.34 4.01,26.17
  Bottom Layer w0.152: v1(18.54,27.42) 18.54,27.44 v1(15.97,30.01) 12.59,33.39 12.59,42.67 16.19,46.27 v1(17.1,46.27)
RD: length 85.1
  Top Layer w0.152: U4.95 19.76,44.29 v1(18.29,44.29) ; 36.49,18.64 36.49,25.92 v1(35.51,26.91) ; RN7.6 7.38,15.12 8.25,15.99 11.03,15.99 12.45,17.41 15.18,17.41 16.52,18.74 16.52,22.89 14.76,24.66 14.76,25.81 17.31,28.36 20.38,28.36 U3.32 U3.32
  Bottom Layer w0.152: v1(18.29,44.29) 14.92,44.29 12.99,42.36 12.99,33.75 v1(18.38,28.37) 21.69,25.05 34.33,25.05 35.51,26.24 v1(35.51,26.91)
RD_EXT: length 5.4
  Top Layer w0.152: 7.39,11.78 7.82,6.44
ROM_A14: length 33.2
  Top Layer w0.152: 45.49,38.38 v1(45.49,41.49) ; v1(21.66,38.8) 21.64,38.78 U4.84
  Bottom Layer w0.152: v1(21.66,38.8) 27.3,38.8 33.14,44.64 43.36,44.64 45.49,42.5 v1(45.49,41.49)
ROM_A15: length 33.9
  Top Layer w0.152: U4.85 19.77,39.28 v1(21.13,39.28) ; 45.99,38.38 45.99,40.82 v1(45.98,40.83)
  Bottom Layer w0.152: v1(45.98,40.83) 45.98,42.62 43.56,45.04 32.94,45.04 27.17,39.28 v1(21.13,39.28)
ROM_A16: length 34.5
  Top Layer w0.152: v1(21.66,39.79) 19.77,39.79 U4.86 ; v1(46.48,41.49) 46.49,41.48 46.49,38.38
  Bottom Layer w0.152: v1(46.48,41.49) 46.48,42.7 43.73,45.45 32.73,45.45 27.07,39.79 v1(21.66,39.79)
ROM_A17: length 59.6
  Top Layer w0.152: v1(45.57,26.23) 45.59,26.21 45.59,20.79 46.49,19.89 46.49,18.64 ; v1(21.07,42.3) 19.78,42.3 U4.91
  Bottom Layer w0.152: v1(45.57,26.23) 45.57,36.99 48.95,40.37 48.95,43.48 44.94,47.48 31.77,47.48 26.59,42.3 v1(21.07,42.3)
ROM_A18: length 32.2
  Top Layer w0.152: 38.49,38.38 38.48,38.37 v1(38.48,36.51) ; v1(16.07,35.24) U4.71
  Bottom Layer w0.152: v1(16.07,35.24) 16.07,34.51 18.29,32.29 28,32.29 34.23,38.52 37.67,38.52 38.48,37.71 v1(38.48,36.51)
ROM_A19: length 30.1
  Top Layer w0.152: 38.99,38.38 38.99,38.38 v1(38.99,37.06) ; v1(16.58,34.66) 16.58,33.1 U4.72
  Bottom Layer w0.152: v1(16.58,34.66) 16.58,34.57 18.41,32.74 27.88,32.74 34.1,38.96 38.02,38.96 38.99,38 v1(38.99,37.06)
ROM_A20: length 28.6
  Top Layer w0.152: v1(23.85,35.88) 22.76,34.78 U4.76 ; 42.49,38.38 42.49,39.72 v1(42.47,39.73)
  Bottom Layer w0.152: v1(42.47,39.73) 42.47,39.74 42.47,40.56 40.83,42.2 34.27,42.2 27.96,35.88 v1(23.85,35.88)
ROM_A21: length 31.6
  Top Layer w0.152: v1(17.97,35.4) 18.07,35.29 U4.75 ; v1(41.98,39.28) 41.99,39.27 41.99,38.38
  Bottom Layer w0.152: v1(41.98,39.28) 41.98,39.28 40.13,41.13 34.52,41.13 27.37,33.98 19.38,33.98 v1(17.97,35.4)
ROM_A22: length 31.5
  Top Layer w0.152: 40.49,38.38 40.49,39.47 v1(40.45,39.51) ; U4.73 17.07,35.45 v1(17.07,35.45)
  Bottom Layer w0.152: v1(17.07,35.45) 17.07,34.67 18.57,33.17 27.71,33.17 34.78,40.24 39.72,40.24 v1(40.45,39.51)
ROM_A23: length 35.5
  Top Layer w0.152: v1(21.12,40.27) 21.11,40.28 U4.87 ; 46.99,38.15 v1(46.99,40.83)
  Bottom Layer w0.152: v1(46.99,40.83) 46.99,42.89 44.02,45.86 32.54,45.86 26.96,40.27 v1(21.12,40.27)
ROM_A24: length 36.2
  Top Layer w0.152: 47.49,38.15 47.47,38.16 v1(47.47,41.49) ; U4.88 v1(21.63,40.78)
  Bottom Layer w0.152: v1(47.47,41.49) 47.47,42.98 44.19,46.26 32.36,46.26 26.88,40.78 v1(21.63,40.78)
ROM_CS: length 44.8
  Top Layer w0.152: U4.47 4.39,36.26 v1(8.07,36.26) ; v1(35.46,25.44) 35.49,25.42 35.49,18.64
  Bottom Layer w0.152: v1(8.07,36.26) 8.07,36.09 8.01,36.03 8.01,33.52 8.3,33.23 12.07,33.23 20.74,24.57 34.59,24.57 v1(35.46,25.44)
RST: length 58.8
  Top Layer w0.152: v1(17.57,34.89) 17.57,34.89 U4.74 ; 45.85,13.64 45.85,14.2 47.98,17 47.98,19.54 46.15,21.37 46.15,26.45 v1(41.45,31.15)
  Bottom Layer w0.152: v1(17.57,34.89) 18.88,33.57 27.54,33.57 34.69,40.72 39.96,40.72 41.45,39.23 v1(41.45,31.15)
RST_EXT: length 5.7
  Top Layer w0.152: 46.88,6.5 45.84,12.1
RX: length 12.6
  Top Layer w0.152: v1(16.15,54.65) 16.15,54.14 16.92,53.38 U7.18
  Bottom Layer w0.152: v1(16.15,54.65) 16.08,54.58 12.2,54.58 11.37,55.4 10.45,55.4 9.3,56.56 U13.3
SCK: length 8.9
  Top Layer w0.152: U9.7 22.86,53.64 21.62,54.88 19.45,54.88 17.57,56.76 U7.2
SCLK: length 5
  Top Layer w0.152: U4.17 10.07,50.63 11.52,52.08 U7.11
SRAM_VCC: length 7.3
  Top Layer w0.254: R1.2 2.51,26.07 3.96,24.62 C2.2 4.28,24.89 U3.8
  Top Layer w0.305: R9.2 R1.2
SWCLK: length 24.2
  Top Layer w0.152: U7.20 18.22,51.01 v1(18.24,50.99)
  Bottom Layer w0.152: U12.2 2.94,58.33 2.94,52.7 5.75,49.89 15.94,49.89 16.35,50.3 17.97,50.3 18.24,50.57 v1(18.24,50.99)
SWDIO: length 22.1
  Top Layer w0.152: v1(17.55,50.82) 17.55,52.06 U7.19
  Bottom Layer w0.152: U12.3 3.99,52.32 6,50.3 15.77,50.3 16.3,50.82 v1(17.55,50.82)
TCK: length 9.2
  Top Layer w0.152: U4.24 6.57,47.28 v1(6.54,47.26)
  Bottom Layer w0.152: v1(6.54,47.26) 2.27,51.53 2.27,51.72 1.08,52.92 XP1.5
TDI: length 10
  Top Layer w0.152: v1(7.11,46.27) 7.07,46.31 U4.23
  Bottom Layer w0.152: v1(7.11,46.27) 5.87,46.27 1.76,50.38 XP1.3
TDO: length 9.8
  Top Layer w0.152: v1(6.5,45.73) 6.5,46.6 6.06,47.04 6.06,48.47 U4.25
  Bottom Layer w0.152: v1(6.5,45.73) 5.55,45.73 2.17,49.11 XP1.2
TMS: length 10
  Top Layer w0.152: v1(7.59,47.23) 7.59,48.46 U4.22
  Bottom Layer w0.152: v1(7.59,47.23) 7.59,47.23 7.1,46.74 6.25,46.74 1.35,51.65 XP1.4
TX: length 11.1
  Top Layer w0.152: v1(15.58,55.06) 15.58,54.02 16.27,53.34 U7.17
  Bottom Layer w0.152: v1(15.58,55.06) 15.54,55.02 12.51,55.02 11.69,55.84 10.96,55.84 10.57,56.23 U13.4
VMIX: length 42.3
  Top Layer w0.254: 2.16,30.63 v1(2.16,31.35) ; v1(21.03,50.55) 23.6,50.55 24.13,51.09 U9.8
  Top Layer w0.305: 4.01,27.67 4.5,28.16 D1.1 4.1,29.19 2.66,30.63 Q1.2
  Bottom Layer w0.254: v1(2.16,31.35) 2.16,37.28 3.01,38.13 3.01,41.66 4.81,43.47 12.46,43.47 15.81,46.82 16.77,46.82 20.51,50.55 v1(21.03,50.55)
WR: length 80.6
  Top Layer w0.152: v1(6.58,15.53) 6.58,15.52 RN7.7 ; v1(14.3,23.37) 14.3,25.94 17.22,28.86 28.4,28.86 31.32,31.78 33.79,31.78 36.28,34.27 40.26,34.27 41.49,35.51 41.49,38.38 ; v1(5.2,26.75) 5.55,26.39 U3.5 7.4,26.39 8.78,26.39 9.51,25.66 9.51,23.96 v1(10.12,23.35) ; v1(6.39,40.78) U4.38
  Bottom Layer w0.152: v1(6.39,40.78) 5.55,40.78 5.14,40.38 5.14,37.07 4.32,36.24 4.32,27.62 v1(5.2,26.75) 6.32,25.62 6.32,23.5 4.97,22.15 4.97,18.26 6.58,16.65 v1(6.58,15.53) ; v1(14.3,23.37) 10.14,23.37 v1(10.12,23.35)
WR_EXT: length 8.3
  Top Layer w0.152: J1.3 RN7.2
$1N55028: length 4.8
  Top Layer w0.203: 26.14,55.85 23.52,55.85 22.86,56.51 22.86,57.76
$1N55030: length 6.5
  Top Layer w0.203: X1.1 25.83,54.25 24.95,55.13 23.38,55.13 21.59,56.91 21.59,57.76
$1N55996: length 1.8
  Top Layer w0.508: 26.68,40.49 26.68,41.53 R7.1
$1N56050: length 1.7
  Top Layer w0.508: R8.1 25.65,38.6 Q2.1

## Copper pours and planes (outline as drawn; the poured copper is in the pictures)
+5V on Top Layer: 1.49,14.4 4.42,14.4 4.42,6.18 1.49,6.18
GND on Top Layer: -0.82,60.62 54.03,60.62 54.03,-0.78 -0.82,-0.78
GND on Bottom Layer: -0.72,60.17 54.05,60.17 54.05,-1.24 -0.72,-1.24

Small or netless copper shapes (teardrops, artwork), in the pictures only: 454 on Top Layer, 179 on Bottom Layer

## Text on the board
Top Solder Mask Layer: VCC | GND | v1.0 | ChisFlash-MBCX
Top Silkscreen Layer: Rev 1.0 | Designed by CQZ | Layout by Mori | FRAM | IS62WV1288 | AT32F421 / F8P7 | DS1302 | RUMBLE | RTC | MX29GL640 | MOS | ChisFlashMBCX              F08S128V01 | v1.0 | GND | TCK | TMS | TDI | TDO | VCC | 3V3 | CLK | DIO | BOOT | RX | TX | - | + | ChisFlash_MBCX
